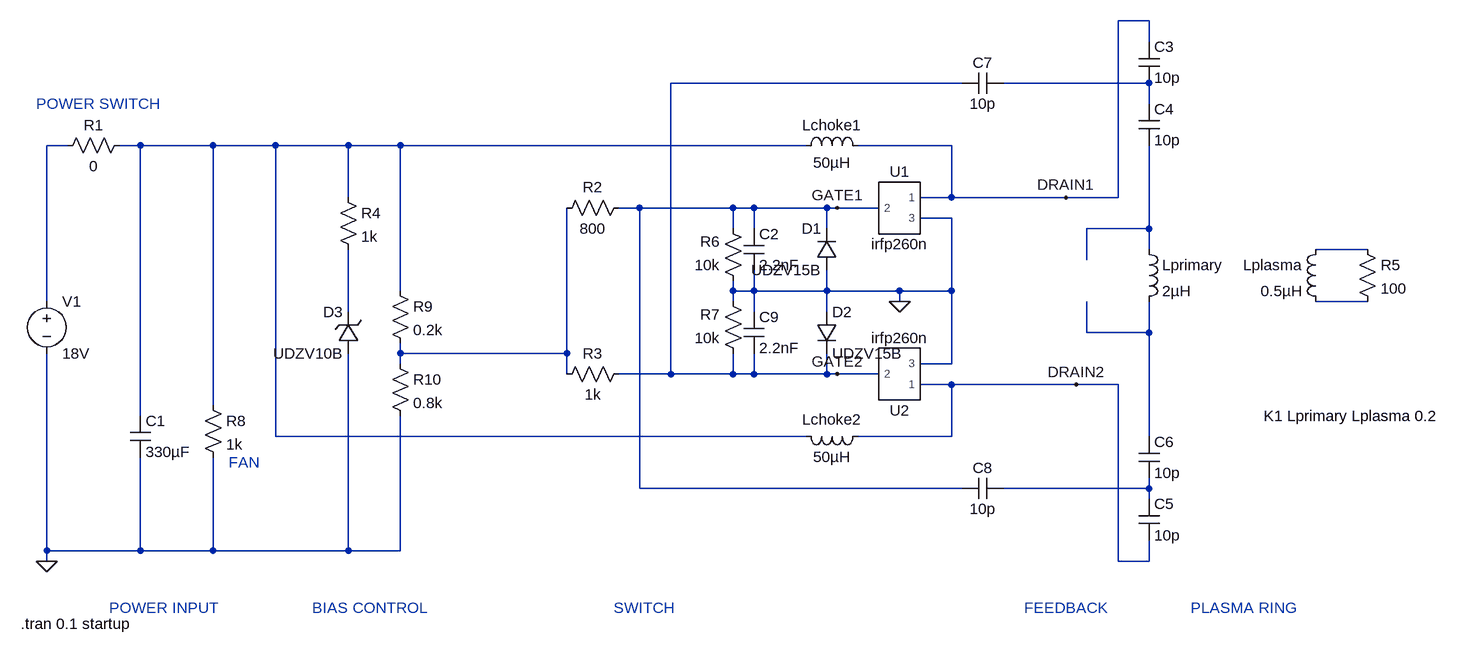
[diagram p0: schematic DualFETZVS.asc]
DualFETZVS.asc, the LTspice schematic file:
Version 4.1
SHEET 1 2388 680
WIRE 1792 -624 1744 -624
WIRE 1792 -592 1792 -624
WIRE 1504 -528 1056 -528
WIRE 1792 -528 1568 -528
WIRE 1792 -496 1792 -528
WIRE 128 -432 96 -432
WIRE 240 -432 208 -432
WIRE 352 -432 240 -432
WIRE 448 -432 352 -432
WIRE 560 -432 448 -432
WIRE 640 -432 560 -432
WIRE 1264 -432 640 -432
WIRE 1488 -432 1344 -432
WIRE 560 -352 560 -432
WIRE 1488 -352 1488 -432
WIRE 1488 -352 1440 -352
WIRE 1664 -352 1488 -352
WIRE 1744 -352 1744 -624
WIRE 1744 -352 1664 -352
WIRE 1008 -336 976 -336
WIRE 1152 -336 1008 -336
WIRE 1184 -336 1152 -336
WIRE 1296 -336 1184 -336
WIRE 1312 -336 1296 -336
WIRE 1376 -336 1312 -336
WIRE 1488 -320 1440 -320
WIRE 1152 -304 1152 -336
WIRE 1184 -304 1184 -336
WIRE 1296 -304 1296 -336
WIRE 1792 -304 1792 -432
WIRE 1792 -304 1696 -304
WIRE 1792 -272 1792 -304
WIRE 2128 -272 2048 -272
WIRE 1696 -256 1696 -304
WIRE 640 -208 640 -432
WIRE 1152 -208 1152 -224
WIRE 1184 -208 1184 -240
WIRE 1184 -208 1152 -208
WIRE 1296 -208 1296 -240
WIRE 1296 -208 1184 -208
WIRE 1408 -208 1296 -208
WIRE 1488 -208 1488 -320
WIRE 1488 -208 1408 -208
WIRE 96 -192 96 -432
WIRE 1152 -192 1152 -208
WIRE 1408 -192 1408 -208
WIRE 2128 -192 2048 -192
WIRE 560 -176 560 -272
WIRE 1184 -176 1184 -208
WIRE 1296 -176 1296 -208
WIRE 1696 -144 1696 -192
WIRE 1792 -144 1792 -192
WIRE 1792 -144 1696 -144
WIRE 640 -112 640 -128
WIRE 896 -112 896 -336
WIRE 896 -112 640 -112
WIRE 640 -96 640 -112
WIRE 1488 -96 1488 -208
WIRE 1488 -96 1440 -96
WIRE 896 -80 896 -112
WIRE 1056 -80 1056 -528
WIRE 1056 -80 976 -80
WIRE 1152 -80 1152 -112
WIRE 1152 -80 1056 -80
WIRE 1184 -80 1184 -112
WIRE 1184 -80 1152 -80
WIRE 1296 -80 1296 -112
WIRE 1296 -80 1184 -80
WIRE 1312 -80 1296 -80
WIRE 1376 -80 1312 -80
WIRE 1488 -64 1440 -64
WIRE 1680 -64 1488 -64
WIRE 1744 -64 1680 -64
WIRE 352 -32 352 -432
WIRE 240 -16 240 -432
WIRE 448 16 448 -432
WIRE 1264 16 448 16
WIRE 1488 16 1488 -64
WIRE 1488 16 1344 16
WIRE 1792 16 1792 -144
WIRE 1008 96 1008 -336
WIRE 1504 96 1008 96
WIRE 1792 96 1792 80
WIRE 1792 96 1568 96
WIRE 1792 112 1792 96
WIRE 96 192 96 -112
WIRE 240 192 240 48
WIRE 240 192 96 192
WIRE 352 192 352 48
WIRE 352 192 240 192
WIRE 560 192 560 -112
WIRE 560 192 352 192
WIRE 640 192 640 -16
WIRE 640 192 560 192
WIRE 96 208 96 192
WIRE 1744 208 1744 -64
WIRE 1792 208 1792 176
WIRE 1792 208 1744 208
FLAG 96 208 0
FLAG 1312 -336 GATE1
FLAG 1664 -352 DRAIN1
FLAG 1408 -192 0
FLAG 1312 -80 GATE2
FLAG 1680 -64 DRAIN2
SYMBOL voltage 96 -208 R0
WINDOW 123 0 0 Left 0
WINDOW 39 0 0 Left 0
SYMATTR InstName V1
SYMATTR Value 18V
SYMBOL res 224 -448 R90
WINDOW 0 0 56 VBottom 2
WINDOW 3 32 56 VTop 2
SYMATTR InstName R1
SYMATTR Value 0
SYMBOL cap 224 -16 R0
SYMATTR InstName C1
SYMATTR Value 330µF
SYMBOL ind 1776 -288 R0
SYMATTR InstName Lprimary
SYMATTR Value 2µH
SYMATTR SpiceLine Rser=16m
SYMBOL ind 2064 -288 M0
SYMATTR InstName Lplasma
SYMATTR Value 0.5µH
SYMBOL res 336 -48 R0
SYMATTR InstName R8
SYMATTR Value 1k
SYMBOL res 2112 -288 R0
SYMATTR InstName R5
SYMATTR Value 100
SYMBOL irfp260n 1408 -336 R0
SYMATTR InstName U1
SYMBOL irfp260n 1408 -80 M180
SYMATTR InstName U2
SYMBOL ind 1248 -416 R270
WINDOW 0 32 56 VTop 2
WINDOW 3 5 56 VBottom 2
SYMATTR InstName Lchoke1
SYMATTR Value 50µH
SYMATTR SpiceLine Rser=16m
SYMBOL ind 1360 0 R90
WINDOW 0 5 56 VBottom 2
WINDOW 3 32 56 VTop 2
SYMATTR InstName Lchoke2
SYMATTR Value 50µH
SYMATTR SpiceLine Rser=16m
SYMBOL res 1168 -208 R180
WINDOW 0 36 76 Left 2
WINDOW 3 36 40 Left 2
SYMATTR InstName R6
SYMATTR Value 10k
SYMBOL res 1168 -96 R180
WINDOW 0 36 76 Left 2
WINDOW 3 36 40 Left 2
SYMATTR InstName R7
SYMATTR Value 10k
SYMBOL res 880 -320 R270
WINDOW 0 32 56 VTop 2
WINDOW 3 0 56 VBottom 2
SYMATTR InstName R2
SYMATTR Value 800
SYMBOL res 880 -64 R270
WINDOW 0 32 56 VTop 2
WINDOW 3 0 56 VBottom 2
SYMATTR InstName R3
SYMATTR Value 1k
SYMBOL cap 1776 -592 R0
SYMATTR InstName C3
SYMATTR Value 10p
SYMBOL cap 1776 -496 R0
SYMATTR InstName C4
SYMATTR Value 10p
SYMBOL cap 1776 112 R0
SYMATTR InstName C5
SYMATTR Value 10p
SYMBOL cap 1776 16 R0
SYMATTR InstName C6
SYMATTR Value 10p
SYMBOL zener 576 -112 R180
WINDOW 0 24 64 Left 2
WINDOW 3 24 0 Left 2
SYMATTR InstName D3
SYMATTR Value UDZV10B
SYMBOL res 544 -368 R0
SYMATTR InstName R4
SYMATTR Value 1k
SYMBOL res 624 -224 R0
SYMATTR InstName R9
SYMATTR Value 0.2k
SYMBOL res 624 -112 R0
SYMATTR InstName R10
SYMATTR Value 0.8k
SYMBOL cap 1168 -304 R0
SYMATTR InstName C2
SYMATTR Value 2.2nF
SYMBOL cap 1168 -176 R0
SYMATTR InstName C9
SYMATTR Value 2.2nF
SYMBOL cap 1568 -544 R90
WINDOW 0 0 32 VBottom 2
WINDOW 3 32 32 VTop 2
SYMATTR InstName C7
SYMATTR Value 10p
SYMBOL cap 1568 80 R90
WINDOW 0 0 32 VBottom 2
WINDOW 3 32 32 VTop 2
SYMATTR InstName C8
SYMATTR Value 10p
SYMBOL diode 1312 -240 R180
WINDOW 0 24 64 Left 2
WINDOW 3 24 0 Left 2
SYMATTR InstName D1
SYMATTR Value UDZV15B
SYMATTR Description Diode
SYMATTR Type diode
SYMBOL diode 1280 -176 R0
SYMATTR InstName D2
SYMATTR Value UDZV15B
SYMATTR Description Diode
SYMATTR Type diode
TEXT 80 -496 Left 2 ;POWER SWITCH
TEXT 376 56 Left 2 ;FAN
TEXT 1968 -16 Left 2 !K1 Lprimary Lplasma 0.2
TEXT 1856 280 Left 2 ;PLASMA RING
TEXT 192 280 Left 2 ;POWER INPUT
TEXT 504 280 Left 2 ;BIAS CONTROL
TEXT 968 280 Left 2 ;SWITCH
TEXT 1600 280 Left 2 ;FEEDBACK
TEXT 56 304 Left 2 !.tran 0.1 startup

The netlist it stands for:
* DualFETZVS.asc
V1 N002 0 18V
R1 N003 N002 0
C1 N003 0 330µF
Lprimary N004 N008 2µH Rser=16m
Lplasma N005 N006 0.5µH
R8 N003 0 1k
R5 N005 N006 100
X§U1 DRAIN1 GATE1 0 irfp260n  ; pins 1 2 3
X§U2 DRAIN2 GATE2 0 irfp260n  ; pins 1 2 3
Lchoke1 N003 DRAIN1 50µH Rser=16m
Lchoke2 DRAIN2 N003 50µH Rser=16m
R6 0 GATE1 10k
R7 GATE2 0 10k
R2 N009 GATE1 800
R3 N009 GATE2 1k
C3 DRAIN1 N001 10p
C4 N001 N004 10p
C5 N010 DRAIN2 10p
C6 N008 N010 10p
D3 0 N007 UDZV10B
R4 N003 N007 1k
R9 N003 N009 0.2k
R10 N009 0 0.8k
C2 GATE1 0 2.2nF
C9 0 GATE2 2.2nF
C7 N001 GATE2 10p
C8 N010 GATE1 10p
D1 0 GATE1 UDZV15B
D2 0 GATE2 UDZV15B
.model D D
.lib standard.dio
* POWER SWITCH
* FAN
K1 Lprimary Lplasma 0.2
* PLASMA RING
* POWER INPUT
* BIAS CONTROL
* SWITCH
* FEEDBACK
.tran 0.1 startup
.lib C:\Users\userl\Downloads\irfp260n.spi
.backanno
.end